# EAGLE schematic ServoSteuerSchaltung (EAGLE 6.2)
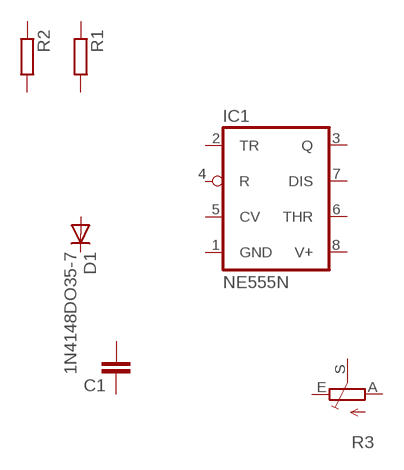
[diagram p0: schematic, sheet 1]

## Parts
C1  C10/4  [C10B4]
D1  1N4148DO35-7  [DO35-7]
IC1  NE555N  [DIL08]
R1  R-EU_0207/10  [0207/10]
R2  R-EU_0207/10  [0207/10]
R3  TRIM_EU-LI15  [LI15]
Unconnected: C1.1 C1.2 D1.A D1.C IC1.2(TR) IC1.3(Q) IC1.4(R) IC1.5(CV) IC1.6(THR) IC1.7(DIS) R1.1 R1.2 R2.1 R2.2 R3.A R3.E R3.S

## Power pins joined to a net without a drawn wire
GND: IC1.1(GND)
V+: IC1.8(V+)

## Library data of the parts
C1 = capacitor-wima:C: CAPACITOR naming: grid - package width
D1 = diode:1N4148: DIODE high speed (Philips)
IC1 = linear:*555: TIMER
R1 R2 = rcl:R-EU_: RESISTOR, European symbol
R3 = pot:TRIM_EU-: POTENTIOMETER